# Altium schematic sheet MCU.SchDoc
size A4
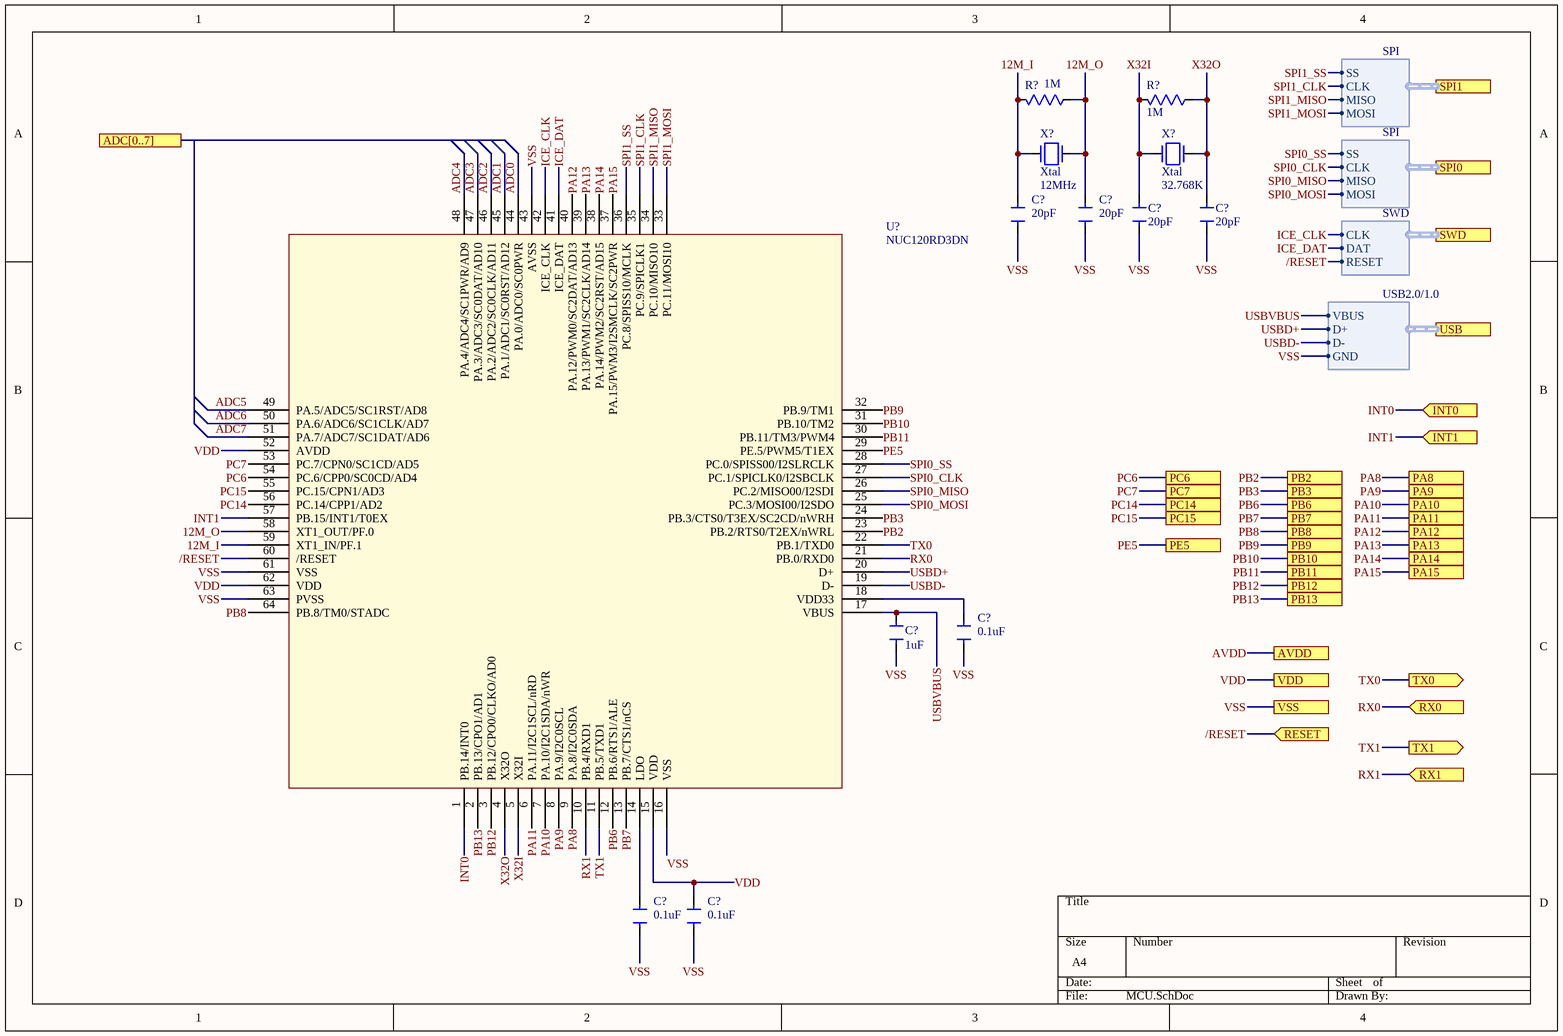
[diagram p0: MCU.SchDoc]

## Parts
(Parts that share a designator on the sheet are numbered #1, #2 ... from top to bottom, then left to right.)
C?#1  value 20pF  [CAP_0402]  (hidden comment: Cap)
C?#2  value 20pF  [CAP_0402]  (hidden comment: Cap)
C?#3  value 20pF  [CAP_0402]  (hidden comment: Cap)
C?#4  value 20pF  [CAP_0402]  (hidden comment: Cap)
C?#5  value 1uF  [CAP_0402]  (hidden comment: Cap)
C?#6  value 0.1uF  [CAP_0402]  (hidden comment: Cap)
C?#7  value 0.1uF  [Cap_0603]  (hidden comment: Cap)
C?#8  value 0.1uF  [CAP_0402]  (hidden comment: Cap)
R?#1  value 1M  [RES_0402]  (hidden comment: Res)
R?#2  value 1M  [RES_0402]  (hidden comment: Res)
U?  NUC120RD3DN  [MCU_LQFP_64_10x10]
X?#1  Xtal  value 12MHz  [2520S]
X?#2  Xtal  value 32.768K  [FC-135]

## Ports
ADC[0..7], AVDD, INT0 (in), INT1 (in), PA8, PA9, PA10, PA11, PA12, PA13, PA14, PA15, PB2, PB3, PB6, PB7, PB8, PB9, PB10, PB11, PB12, PB13, PC6, PC7, PC14, PC15, PE5, RESET (in), RX0 (in), RX1 (in), SPI0 (harness SPI), SPI1 (harness SPI), SWD (harness SWD), TX0 (out), TX1 (out), USB (harness USB2.0/1.0), VDD, VSS

## Harnesses
SPI: SS, CLK, MISO, MOSI
SWD: CLK, DAT, RESET
USB2.0/1.0: D+, D-, GND, VBUS

## Nets
12M_I: C?#1.1 R?#1.1 U?.59(XT1_IN/PF.1) X?#1.2
12M_O: C?#2.1 R?#1.2 U?.58(XT1_OUT/PF.0) X?#1.1
/RESET: U?.60(/RESET) ; port RESET, port SWD.RESET
ADC0: U?.44(PA.0/ADC0/SC0PWR)
ADC1: U?.45(PA.1/ADC1/SC0RST/AD12)
ADC2: U?.46(PA.2/ADC2/SC0CLK/AD11)
ADC3: U?.47(PA.3/ADC3/SC0DAT/AD10)
ADC4: U?.48(PA.4/ADC4/SC1PWR/AD9)
ADC5: U?.49(PA.5/ADC5/SC1RST/AD8)
ADC6: U?.50(PA.6/ADC6/SC1CLK/AD7)
ADC7: U?.51(PA.7/ADC7/SC1DAT/AD6)
AVDD: port AVDD
ICE_CLK: U?.42(ICE_CLK) ; port SWD.CLK
ICE_DAT: U?.41(ICE_DAT) ; port SWD.DAT
INT0: U?.1(PB.14/INT0) ; port INT0
INT1: U?.57(PB.15/INT1/T0EX) ; port INT1
PA8: U?.9(PA.8/I2C0SDA) ; port PA8
PA9: U?.8(PA.9/I2C0SCL) ; port PA9
PA10: U?.7(PA.10/I2C1SDA/nWR) ; port PA10
PA11: U?.6(PA.11/I2C1SCL/nRD) ; port PA11
PA12: U?.40(PA.12/PWM0/SC2DAT/AD13) ; port PA12
PA13: U?.39(PA.13/PWM1/SC2CLK/AD14) ; port PA13
PA14: U?.38(PA.14/PWM2/SC2RST/AD15) ; port PA14
PA15: U?.37(PA.15/PWM3/I2SMCLK/SC2PWR) ; port PA15
PB2: U?.23(PB.2/RTS0/T2EX/nWRL) ; port PB2
PB3: U?.24(PB.3/CTS0/T3EX/SC2CD/nWRH) ; port PB3
PB6: U?.12(PB.6/RTS1/ALE) ; port PB6
PB7: U?.13(PB.7/CTS1/nCS) ; port PB7
PB8: U?.64(PB.8/TM0/STADC) ; port PB8
PB9: U?.32(PB.9/TM1) ; port PB9
PB10: U?.31(PB.10/TM2) ; port PB10
PB11: U?.30(PB.11/TM3/PWM4) ; port PB11
PB12: U?.3(PB.12/CPO0/CLKO/AD0) ; port PB12
PB13: U?.2(PB.13/CPO1/AD1) ; port PB13
PC6: U?.54(PC.6/CPP0/SC0CD/AD4) ; port PC6
PC7: U?.53(PC.7/CPN0/SC1CD/AD5) ; port PC7
PC14: U?.56(PC.14/CPP1/AD2) ; port PC14
PC15: U?.55(PC.15/CPN1/AD3) ; port PC15
PE5: U?.29(PE.5/PWM5/T1EX) ; port PE5
RX0: U?.21(PB.0/RXD0) ; port RX0
RX1: U?.10(PB.4/RXD1) ; port RX1
SPI0_CLK: U?.27(PC.1/SPICLK0/I2SBCLK) ; port SPI0.CLK
SPI0_MISO: U?.26(PC.2/MISO00/I2SDI) ; port SPI0.MISO
SPI0_MOSI: U?.25(PC.3/MOSI00/I2SDO) ; port SPI0.MOSI
SPI0_SS: U?.28(PC.0/SPISS00/I2SLRCLK) ; port SPI0.SS
SPI1_CLK: U?.35(PC.9/SPICLK1) ; port SPI1.CLK
SPI1_MISO: U?.34(PC.10/MISO10) ; port SPI1.MISO
SPI1_MOSI: U?.33(PC.11/MOSI10) ; port SPI1.MOSI
SPI1_SS: U?.36(PC.8/SPISS10/MCLK) ; port SPI1.SS
TX0: U?.22(PB.1/TXD0) ; port TX0
TX1: U?.11(PB.5/TXD1) ; port TX1
USBD+: U?.20(D+) ; port USB.D+
USBD-: U?.19(D-) ; port USB.D-
USBVBUS: C?#5.1 U?.17(VBUS) ; port USB.VBUS
VDD: C?#8.1 U?.15(VDD) U?.52(AVDD) U?.62(VDD) ; port VDD
VSS: C?#1.2 C?#2.2 C?#3.2 C?#4.2 C?#5.2 C?#6.2 C?#7.2 C?#8.2 U?.16(VSS) U?.43(AVSS) U?.61(VSS) U?.63(PVSS) ; port VSS, port USB.GND
X32I: C?#3.1 R?#2.1 U?.5(X32I) X?#2.2
X32O: C?#4.1 R?#2.2 U?.4(X32O) X?#2.1
NetC?#6_1: C?#6.1 U?.18(VDD33)
NetC?#7_1: C?#7.1 U?.14(LDO)

## Library data of the parts
U? = NUC120RD3DN: OriginalSymbolOrigin: (0,0)